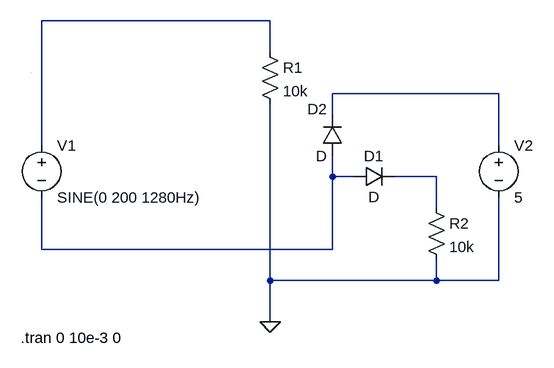
[diagram p0: schematic Draft1.asc]
Draft1.asc, the LTspice schematic file:
Version 4
SHEET 1 880 680
WIRE 368 -80 16 -80
WIRE 368 -32 368 -80
WIRE 720 32 464 32
WIRE 464 64 464 32
WIRE 16 112 16 -80
WIRE 720 112 720 32
WIRE 464 160 464 128
WIRE 496 160 464 160
WIRE 624 160 560 160
WIRE 624 208 624 160
WIRE 16 272 16 192
WIRE 464 272 464 160
WIRE 464 272 16 272
WIRE 368 320 368 48
WIRE 624 320 624 288
WIRE 624 320 368 320
WIRE 720 320 720 192
WIRE 720 320 624 320
WIRE 368 384 368 320
WIRE 0 0 0 0
FLAG 368 384 0
SYMBOL voltage 16 96 R0
WINDOW 123 0 0 Left 2
WINDOW 39 0 0 Left 2
SYMATTR InstName V1
SYMATTR Value SINE(0 200 1280Hz)
SYMBOL voltage 720 96 R0
WINDOW 123 0 0 Left 2
WINDOW 39 0 0 Left 2
SYMATTR InstName V2
SYMATTR Value 5
SYMBOL res 352 -48 R0
SYMATTR InstName R1
SYMATTR Value 10k
SYMBOL diode 496 176 R270
WINDOW 0 32 32 VTop 2
WINDOW 3 0 32 VBottom 2
SYMATTR InstName D1
SYMBOL diode 480 128 R180
WINDOW 0 24 72 Left 2
WINDOW 3 24 0 Left 2
SYMATTR InstName D2
SYMBOL res 608 192 R0
SYMATTR InstName R2
SYMATTR Value 10k
TEXT -16 408 Left 2 !.tran 0 10e-3 0

The netlist it stands for:
* Draft1.asc
V1 N001 N003 SINE(0 200 1280Hz)
V2 N002 0 5
R1 N001 0 10k
D1 N003 N004 D
D2 N003 N002 D
R2 N004 0 10k
.model D D
.lib standard.dio
.tran 0 10e-3 0
.backanno
.end